# Altium schematic sheet jumper.schdoc
size 54 x 53 mm
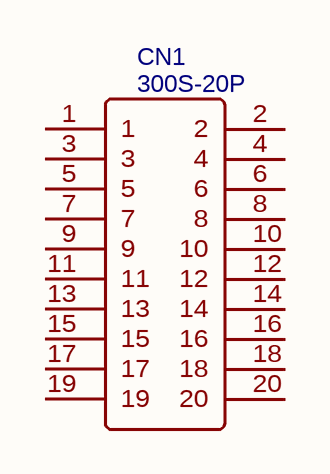
[diagram p0: jumper.schdoc]

## Parts
CN1  300S-20P  [CONN-TH_300S-20P]

## Nets

Not connected (* = marked no-connect by the designer): CN1 1 2 3 4 5 6 7 8 9 10 11 12 13 14 15 16 17 18 19 20

## Library data of the parts
CN1 = 300S-20P: BOM_Manufacturer: Shenzhen Cankemeng; Contributor: LCSC; BOM_Supplier: LCSC; BOM_Supplier Part: C132442; BOM_Manufacturer Part: -; BOM_JLCPCB Part Class: Extended Part; spicePre: C; spiceSymbolName: 300S-20P